# EAGLE schematic main (EAGLE 6.4)
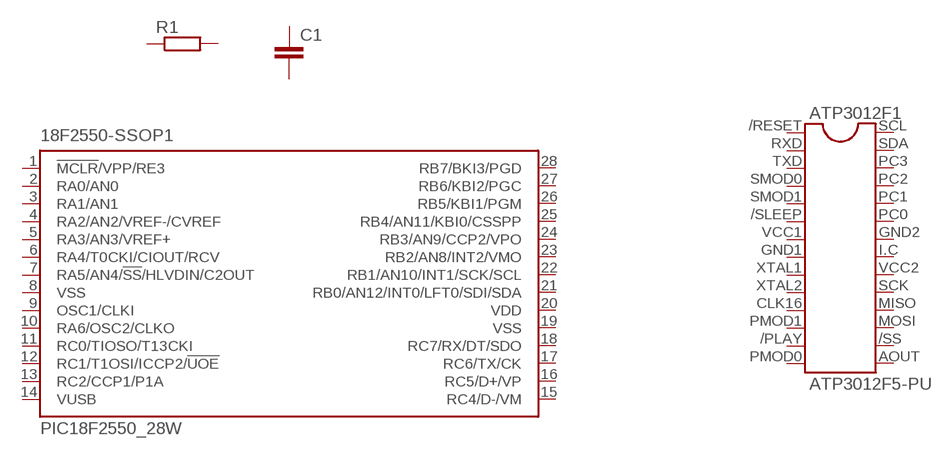
[diagram p0: schematic, sheet 1]

## Parts
18F2550-SSOP1  PIC18F2550_28W  [SO28W]
ATP3012F1  ATP3012F5-PU  [ATP3012F5-PU]
C1  C-EUC3216  [C3216]
R1  R-EU_M3216  [M3216]
Unconnected: 18F2550-SSOP1.1(!MCLR!/VPP/RE3) 18F2550-SSOP1.2(RA0/AN0) 18F2550-SSOP1.3(RA1/AN1) 18F2550-SSOP1.4(RA2/AN2/VREF-/CVREF) 18F2550-SSOP1.5(RA3/AN3/VREF+) 18F2550-SSOP1.6(RA4/T0CKI/CIOUT/RCV) 18F2550-SSOP1.7(RA5/AN4/!SS!/HLVDIN/C2OUT) 18F2550-SSOP1.9(OSC1/CLKI) 18F2550-SSOP1.10(RA6/OSC2/CLKO) 18F2550-SSOP1.11(RC0/TIOSO/T13CKI) 18F2550-SSOP1.12(RC1/T1OSI/ICCP2/!UOE) 18F2550-SSOP1.13(RC2/CCP1/P1A) 18F2550-SSOP1.14(VUSB) 18F2550-SSOP1.15(RC4/D-/VM) 18F2550-SSOP1.16(RC5/D+/VP) 18F2550-SSOP1.17(RC6/TX/CK) 18F2550-SSOP1.18(RC7/RX/DT/SDO) 18F2550-SSOP1.21(RB0/AN12/INT0/LFT0/SDI/SDA) 18F2550-SSOP1.22(RB1/AN10/INT1/SCK/SCL) 18F2550-SSOP1.23(RB2/AN8/INT2/VMO) 18F2550-SSOP1.24(RB3/AN9/CCP2/VPO) 18F2550-SSOP1.25(RB4/AN11/KBI0/CSSPP) 18F2550-SSOP1.26(RB5/KBI1/PGM) 18F2550-SSOP1.27(RB6/KBI2/PGC) 18F2550-SSOP1.28(RB7/BKI3/PGD) ATP3012F1./PLAY ATP3012F1./RESET ATP3012F1./SLEEP ATP3012F1./SS ATP3012F1.AOUT ATP3012F1.CLK16 ATP3012F1.GND1 ATP3012F1.GND2 ATP3012F1.I.C ATP3012F1.MISO ATP3012F1.MOSI ATP3012F1.PC0 ATP3012F1.PC1 ATP3012F1.PC2 ATP3012F1.PC3 ATP3012F1.PMOD0 ATP3012F1.PMOD1 ATP3012F1.RXD ATP3012F1.SCK ATP3012F1.SCL ATP3012F1.SDA ATP3012F1.SMOD0 ATP3012F1.SMOD1 ATP3012F1.TXD ATP3012F1.VCC1 ATP3012F1.VCC2 ATP3012F1.XTAL1 ATP3012F1.XTAL2 C1.1 C1.2 R1.1 R1.2

## Power pins joined to a net without a drawn wire
VDD: 18F2550-SSOP1.20(VDD)
VSS: 18F2550-SSOP1.8(VSS) 18F2550-SSOP1.19(VSS)

## Library data of the parts
18F2550-SSOP1 = microchip:PIC18F2*_28: USB Microcontrollers with nanoWatt Technology High-Performance, Enhanced Flash, 28/40/44-Pin, Source: http://ww1.microchip.com/downloads/en/devicedoc/39632c.pdf; MF: MICROCHIP; MPN: PIC18F2550-I/SO; OC_FARNELL: 9321268; OC_NEWARK: 73K1297
ATP3012F1 = ATP:ATP3012F5-PU
C1 = resistor:C-EU: CAPACITOR, European symbol
R1 = resistor:R-EU_: RESISTOR, European symbol